# Altium project UCLA-DRS4-2.1.PrjPCB (part 3 of 7)

## Sheet MarsCarrier.SchDoc: My title
size A3; Organization: University of California; Address1: 475 Portola Plaza; Address2: Los Angeles, CA 90095; Revision: R01; SheetNumber: 1; SheetTotal: 1
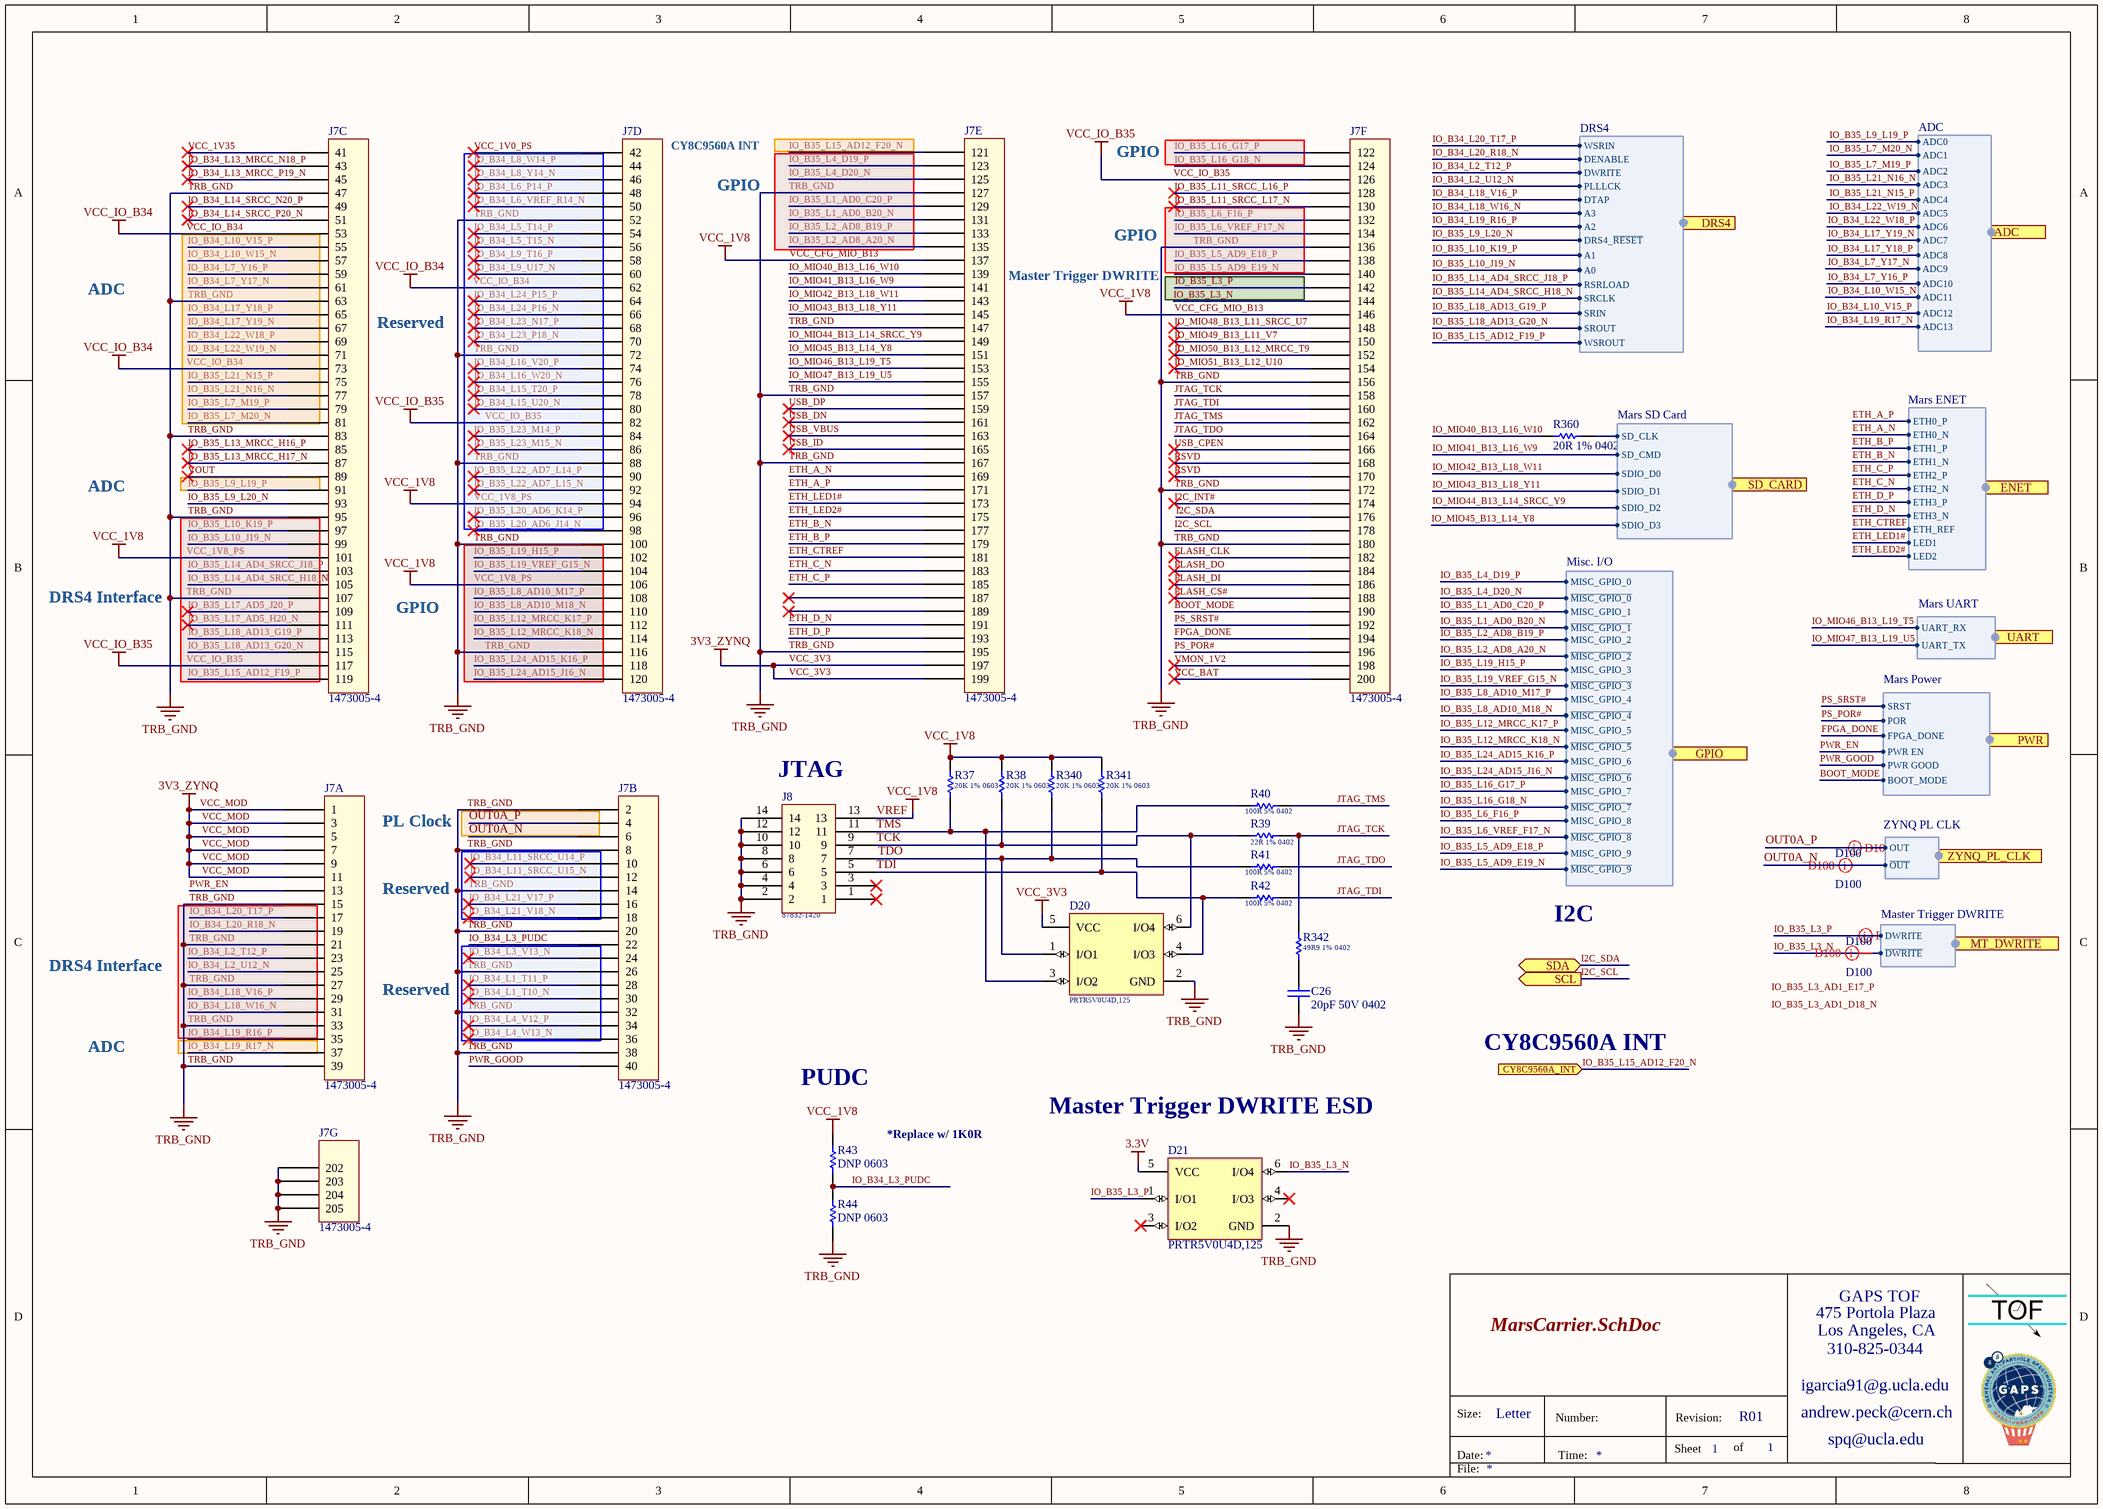
[diagram p6: MarsCarrier.SchDoc]

### Parts
C26  Capacitance: 20pF 50V 0402  [Cap_Murata_GJM1555C1H200GB01D_20pF]  (hidden comment: Cap_Murata_GJM1555C1H200GB01D_20pF)
D20  PRTR5V0U4D,125  [PRTR5V0U4D,125]
D21  PRTR5V0U4D,125  [PRTR5V0U4D,125]
J7  Series: 1473005-4  [DIMM_TE_Connectivity_1473005-4_200POS]  (hidden comment: DIMM_TE_Connectivity_1473005-4_200POS)  (parts A,B,C,D,E,F,G of 7)
J8  Series: 87832-1420  [Header_Molex_87832-1420_14POS]  (hidden comment: Header_Molex_87832-1420_14POS)
R37  20K 1% 0603  [RESC0603(1608)_L]
R38  20K 1% 0603  [RESC0603(1608)_L]
R39  22R 1% 0402  [RESC0402(1005)_L]
R40  100R 5% 0402  [RESC0402(1005)_L]
R41  100R 5% 0402  [RESC0402(1005)_L]
R42  100R 5% 0402  [RESC0402(1005)_L]
R43  Resistance: DNP 0603  [RES_DNP_0603]  (hidden comment: RES_DNP_0603)
R44  Resistance: DNP 0603  [RES_DNP_0603]  (hidden comment: RES_DNP_0603)
R340  20K 1% 0603  [RESC0603(1608)_L]
R341  20K 1% 0603  [RESC0603(1608)_L]
R342  49R9 1% 0402  [RESC0402(1005)_L]
R360  Resistance: 20R 1% 0402  [Res_ROHM_SFR01MZPF20R0_20_Ohm]  (hidden comment: Res_ROHM_SFR01MZPF20R0_20_Ohm)

### Ports
ADC (harness ADC), CY8C9560A_INT (in), DRS4 (harness DRS4), ENET (harness Mars ENET), GPIO (harness Misc. I/O), MT_DWRITE (harness Master Trigger DWRITE), PWR (harness Mars Power), SCL (out), SD_CARD (harness Mars SD Card), SDA (bidir), UART (harness Mars UART), ZYNQ_PL_CLK (harness ZYNQ PL CLK)

### Harnesses
Mars SD Card: SDIO_D2, SDIO_D1, SDIO_D0, SD_CMD, SD_CLK, SDIO_D3
Mars UART: UART_RX, UART_TX
ADC: ADC0, ADC1, ADC2, ADC3, ADC4, ADC5, ADC6, ADC7, ADC8, ADC9, ADC10, ADC11, ADC12, ADC13
Mars ENET: ETH0_P, ETH0_N, ETH1_P, ETH1_N, ETH2_P, ETH2_N, ETH3_P, ETH3_N, ETH_REF, LED1, LED2
Mars Power: PWR GOOD, PWR EN, FPGA_DONE, SRST, POR, BOOT_MODE
ZYNQ PL CLK: OUT, ~{OUT}
Misc. I/O: MISC_GPIO_0, ~{MISC_GPIO_0}, MISC_GPIO_1, ~{MISC_GPIO_1}, MISC_GPIO_2, ~{MISC_GPIO_2}, MISC_GPIO_3, ~{MISC_GPIO_3}, MISC_GPIO_4, ~{MISC_GPIO_4}, MISC_GPIO_5, ~{MISC_GPIO_5}, MISC_GPIO_6, ~{MISC_GPIO_6}, MISC_GPIO_7, ~{MISC_GPIO_7}, MISC_GPIO_8, ~{MISC_GPIO_8}, MISC_GPIO_9, ~{MISC_GPIO_9}
Master Trigger DWRITE: DWRITE, ~{DWRITE}
DRS4: A3, A2, A1, A0, DTAP, SROUT, SRCLK, SRIN, RSRLOAD, WSROUT, DWRITE, PLLLCK, WSRIN, DENABLE, DRS4_~{RESET}

### Nets
3.3V: D21.5(VCC)
TRB_GND: C26.1 D20.2(GND) D21.2(GND) J7.2 J7.8 J7.14 J7.15 J7.20 J7.21 J7.26 J7.27 J7.32 J7.33 J7.38 J7.39 J7.47 J7.52 J7.63 J7.72 J7.83 J7.88 J7.95 J7.100 J7.107 J7.116 J7.127 J7.136 J7.147 J7.156 J7.157 J7.167 J7.172 J7.180 J7.195 J7.202 J7.203 J7.204 J7.205 J8.2 J8.4 J8.6 J8.8 J8.10 J8.12 J8.14 R44.2
VCC_1V8_PS: J7.94 J7.101 J7.106 J7.137 J7.146 J8.13 R37.2 R38.2 R43.1 R340.2 R341.2  [also labelled VCC_1V8, VCC_CFG_MIO_B13, VREF]
VCC_3V3: D20.5(VCC) J7.1 J7.3 J7.5 J7.7 J7.9 J7.11 J7.197 J7.199  [also labelled 3V3_ZYNQ, VCC_MOD]
VCC_IO_B34: J7.53 J7.62 J7.73 J7.82 J7.117 J7.126  [also labelled VCC_IO_B35]
BOOT_MODE: J7.190 ; port PWR.BOOT_MODE
ETH_A_N: J7.169 ; port ENET.ETH0_N
ETH_A_P: J7.171 ; port ENET.ETH0_P
ETH_B_N: J7.177 ; port ENET.ETH1_N
ETH_B_P: J7.179 ; port ENET.ETH1_P
ETH_C_N: J7.183 ; port ENET.ETH2_N
ETH_C_P: J7.185 ; port ENET.ETH2_P
ETH_CTREF: J7.181 ; port ENET.ETH_REF
ETH_D_N: J7.191 ; port ENET.ETH3_N
ETH_D_P: J7.193 ; port ENET.ETH3_P
ETH_LED1#: J7.173 ; port ENET.LED1
ETH_LED2#: J7.175 ; port ENET.LED2
FLASH_CLK: J7.182
FLASH_CS#: J7.188
FLASH_DI: J7.186
FLASH_DO: J7.184
FPGA_DONE: J7.194 ; port PWR.FPGA_DONE
I2C_INT#: J7.174
I2C_SCL: J7.178 ; port SCL
I2C_SDA: J7.176 ; port SDA
IO_B34_L1_T10_N: J7.30
IO_B34_L1_T11_P: J7.28
IO_B34_L2_T12_P: J7.23 ; port DRS4.DWRITE  [project net DRS4_DWRITE]
IO_B34_L2_U12_N: J7.25 ; port DRS4.PLLLCK  [project net DRS4_PLLLCK]
IO_B34_L3_PUDC: J7.22 R43.2 R44.1
IO_B34_L3_V13_N: J7.24
IO_B34_L4_V12_P: J7.34
IO_B34_L4_W13_N: J7.36
IO_B34_L5_T14_P: J7.54
IO_B34_L5_T15_N: J7.56
IO_B34_L6_P14_P: J7.48
IO_B34_L6_VREF_R14_N: J7.50
IO_B34_L7_Y16_P: J7.59 ; port ADC.ADC10
IO_B34_L7_Y17_N: J7.61 ; port ADC.ADC9
IO_B34_L8_W14_P: J7.44
IO_B34_L8_Y14_N: J7.46
IO_B34_L9_T16_P: J7.58
IO_B34_L9_U17_N: J7.60
IO_B34_L10_V15_P: J7.55 ; port ADC.ADC12
IO_B34_L10_W15_N: J7.57 ; port ADC.ADC11
IO_B34_L11_SRCC_U14_P: J7.10
IO_B34_L11_SRCC_U15_N: J7.12
IO_B34_L13_MRCC_N18_P: J7.43
IO_B34_L13_MRCC_P19_N: J7.45
IO_B34_L14_SRCC_N20_P: J7.49
IO_B34_L14_SRCC_P20_N: J7.51
IO_B34_L15_T20_P: J7.78
IO_B34_L15_U20_N: J7.80
IO_B34_L16_V20_P: J7.74
IO_B34_L16_W20_N: J7.76
IO_B34_L17_Y18_P: J7.65 ; port ADC.ADC8
IO_B34_L17_Y19_N: J7.67 ; port ADC.ADC7
IO_B34_L18_V16_P: J7.29 ; port DRS4.DTAP  [project net DRS4_DTAP]
IO_B34_L18_W16_N: J7.31 ; port DRS4.A3  [project net DRS4_A3]
IO_B34_L19_R16_P: J7.35 ; port DRS4.A2  [project net DRS4_A2]
IO_B34_L19_R17_N: J7.37 ; port ADC.ADC13
IO_B34_L20_R18_N: J7.19 ; port DRS4.DENABLE  [project net DRS4_DENABLE]
IO_B34_L20_T17_P: J7.17 ; port DRS4.WSRIN  [project net DRS4_WSRIN]
IO_B34_L21_V17_P: J7.16
IO_B34_L21_V18_N: J7.18
IO_B34_L22_W18_P: J7.69 ; port ADC.ADC6
IO_B34_L22_W19_N: J7.71 ; port ADC.ADC5
IO_B34_L23_N17_P: J7.68
IO_B34_L23_P18_N: J7.70
IO_B34_L24_P15_P: J7.64
IO_B34_L24_P16_N: J7.66
IO_B35_L1_AD0_B20_N: J7.131 ; port GPIO.~{MISC_GPIO_1}  [project net GPIO1_N]
IO_B35_L1_AD0_C20_P: J7.129 ; port GPIO.MISC_GPIO_1  [project net GPIO1_P]
IO_B35_L2_AD8_A20_N: J7.135 ; port GPIO.~{MISC_GPIO_2}  [project net GPIO2_N]
IO_B35_L2_AD8_B19_P: J7.133 ; port GPIO.MISC_GPIO_2  [project net GPIO2_P]
IO_B35_L3_N: D21.6(I/O4) J7.144 ; port MT_DWRITE.~{DWRITE}
IO_B35_L3_P: D21.1(I/O1) J7.142 ; port MT_DWRITE.DWRITE
IO_B35_L4_D19_P: J7.123 ; port GPIO.MISC_GPIO_0  [project net GPIO0_P]
IO_B35_L4_D20_N: J7.125 ; port GPIO.~{MISC_GPIO_0}  [project net GPIO0_N]
IO_B35_L5_AD9_E18_P: J7.138 ; port GPIO.MISC_GPIO_9  [project net GPIO9_P]
IO_B35_L5_AD9_E19_N: J7.140 ; port GPIO.~{MISC_GPIO_9}  [project net GPIO9_N]
IO_B35_L6_F16_P: J7.132 ; port GPIO.MISC_GPIO_8  [project net GPIO8_P]
IO_B35_L6_VREF_F17_N: J7.134 ; port GPIO.~{MISC_GPIO_8}  [project net GPIO8_N]
IO_B35_L7_M19_P: J7.79 ; port ADC.ADC2
IO_B35_L7_M20_N: J7.81 ; port ADC.ADC1
IO_B35_L8_AD10_M17_P: J7.108 ; port GPIO.MISC_GPIO_4  [project net GPIO4_P]
IO_B35_L8_AD10_M18_N: J7.110 ; port GPIO.~{MISC_GPIO_4}  [project net GPIO4_N]
IO_B35_L9_L19_P: J7.91 ; port ADC.ADC0
IO_B35_L9_L20_N: J7.93 ; port DRS4.DRS4_~{RESET}  [project net DRS4~{_RESET}]
IO_B35_L10_J19_N: J7.99 ; port DRS4.A0  [project net DRS4_A0]
IO_B35_L10_K19_P: J7.97 ; port DRS4.A1  [project net DRS4_A1]
IO_B35_L11_SRCC_L16_P: J7.128
IO_B35_L11_SRCC_L17_N: J7.130
IO_B35_L12_MRCC_K17_P: J7.112 ; port GPIO.MISC_GPIO_5  [project net GPIO5_P]
IO_B35_L12_MRCC_K18_N: J7.114 ; port GPIO.~{MISC_GPIO_5}  [project net GPIO5_N]
IO_B35_L13_MRCC_H16_P: J7.85
IO_B35_L13_MRCC_H17_N: J7.87
IO_B35_L14_AD4_SRCC_H18_N: J7.105 ; port DRS4.SRCLK  [project net DRS4_SRCLK]
IO_B35_L14_AD4_SRCC_J18_P: J7.103 ; port DRS4.RSRLOAD  [project net DRS4_RSRLOAD]
IO_B35_L15_AD12_F19_P: J7.119 ; port DRS4.WSROUT  [project net DRS4_WSROUT]
IO_B35_L15_AD12_F20_N: J7.121 ; port CY8C9560A_INT
IO_B35_L16_G17_P: J7.122 ; port GPIO.MISC_GPIO_7  [project net GPIO7_P]
IO_B35_L16_G18_N: J7.124 ; port GPIO.~{MISC_GPIO_7}  [project net GPIO7_N]
IO_B35_L17_AD5_H20_N: J7.111
IO_B35_L17_AD5_J20_P: J7.109
IO_B35_L18_AD13_G19_P: J7.113 ; port DRS4.SRIN  [project net DRS4_SRIN]
IO_B35_L18_AD13_G20_N: J7.115 ; port DRS4.SROUT  [project net DRS4_SROUT]
IO_B35_L19_H15_P: J7.102 ; port GPIO.MISC_GPIO_3  [project net GPIO3_P]
IO_B35_L19_VREF_G15_N: J7.104 ; port GPIO.~{MISC_GPIO_3}  [project net GPIO3_N]
IO_B35_L20_AD6_J14_N: J7.98
IO_B35_L20_AD6_K14_P: J7.96
IO_B35_L21_N15_P: J7.75 ; port ADC.ADC4
IO_B35_L21_N16_N: J7.77 ; port ADC.ADC3
IO_B35_L22_AD7_L14_P: J7.90
IO_B35_L22_AD7_L15_N: J7.92
IO_B35_L23_M14_P: J7.84
IO_B35_L23_M15_N: J7.86
IO_B35_L24_AD15_J16_N: J7.120 ; port GPIO.~{MISC_GPIO_6}  [project net GPIO6_N]
IO_B35_L24_AD15_K16_P: J7.118 ; port GPIO.MISC_GPIO_6  [project net GPIO6_P]
IO_MIO40_B13_L16_W10: J7.139 R360.1
IO_MIO41_B13_L16_W9: J7.141 ; port SD_CARD.SD_CMD
IO_MIO42_B13_L18_W11: J7.143 ; port SD_CARD.SDIO_D0
IO_MIO43_B13_L18_Y11: J7.145 ; port SD_CARD.SDIO_D1
IO_MIO44_B13_L14_SRCC_Y9: J7.149 ; port SD_CARD.SDIO_D2
IO_MIO45_B13_L14_Y8: J7.151 ; port SD_CARD.SDIO_D3
IO_MIO46_B13_L19_T5: J7.153 ; port UART.UART_RX
IO_MIO47_B13_L19_U5: J7.155 ; port UART.UART_TX
IO_MIO48_B13_L11_SRCC_U7: J7.148
IO_MIO49_B13_L11_V7: J7.150
IO_MIO50_B13_L12_MRCC_T9: J7.152
IO_MIO51_B13_L12_U10: J7.154
JTAG_TCK: J7.158 R39.1 R342.1
JTAG_TDI: J7.160 R42.1
JTAG_TDO: J7.164 R41.1
JTAG_TMS: J7.162 R40.1
OUT0A_N: J7.6 ; port ZYNQ_PL_CLK.~{OUT}
OUT0A_P: J7.4 ; port ZYNQ_PL_CLK.OUT
PS_POR#: J7.196 ; port PWR.POR  [project net POR]
PS_SRST#: J7.192 ; port PWR.SRST
PWR_EN: J7.13 ; port PWR.PWR EN  [project net POWER_EN]
PWR_GOOD: J7.40 ; port PWR.PWR GOOD  [project net POWER_GOOD]
RSVD: J7.168 J7.170
SDIO_CLK: R360.2 ; port SD_CARD.SD_CLK
TCK: D20.6(I/O4) J8.9 R38.1 R39.2
TDI: D20.4(I/O3) J8.5 R42.2 R341.1
TDO: D20.1(I/O1) J8.7 R41.2 R340.1
TMS: D20.3(I/O2) J8.11 R37.1 R40.2
USB_CPEN: J7.166
USB_DN: J7.161
USB_DP: J7.159
USB_ID: J7.165
USB_VBUS: J7.163
VCC_1V0_PS: J7.42
VCC_1V35: J7.41
VCC_BAT: J7.200
VMON_1V2: J7.198
VOUT: J7.89
NetC26_2: C26.2 R342.2

Not connected (* = marked no-connect by the designer): D21 3(I/O2)* 4(I/O3)*; J7 187* 189*; J8 1* 3*

### Layout directives
differential pair; differential pair class D100: IO_B35_L3_N, IO_B35_L3_P, OUT0A_N, OUT0A_P

### Notes on the sheet
- (near J7) CY8C9560A INT
- GPIO
- ADC
- (near J7) Master Trigger DWRITE
- (near J7) Reserved
- DRS4 Interface
- (near J8) JTAG
- PL Clock
- Reserved
- I2C
- CY8C9560A INT
- PUDC
- (near D21) Master Trigger DWRITE ESD
- *Replace w/ 1K0R
- Labels drawn without touching a wire or pin: IO_B35_L3_AD1_D18_N, IO_B35_L3_AD1_E17_P
- 475 Portola Plaza
- GAPS TOF
- igarcia91@g.ucla.edu
- Los Angeles, CA
- 310-825-0344
- Size:
- Date:
- Letter
- Number:
- Time:
- Sheet
- Revision:
- of
- andrew.peck@cern.ch
- spq@ucla.edu
- File:

### Library data of the parts
C26 = Cap_Murata_GJM1555C1H200GB01D_20pF: Multilayer Ceramic Capacitors MLCC - SMD/SMT 0402 20pF 50Volts C0G 2%; Supplier 1: Mouser; Supplier Part Number 1: 81-GJM1555C1H200GB01
D20 D21 = PRTR5V0U4D,125: ESD Suppressors / TVS Diodes 5.5V QUAD R-R ESD ULTRA LOW CAP; Supplier 1: Mouser; Supplier Part Number 1: 771-PRTR5V0U4D-T/R
J7 = DIMM_TE_Connectivity_1473005-4_200POS: DIMM Connectors DDR2 SODIMM 200P STANDARD HOUSING; Supplier 1: Mouser; Supplier Part Number 1: 571-1473005-4
J8 = Header_Molex_87832-1420_14POS: Headers & Wire Housings 14P SMD PB FREE SHRD; Supplier Part Number 1: 538-87832-1420; Supplier 1: Mouser
R37 R38 R340 R341 = CMP-1012-00655-1: 20K 0.1W 1% 0603 (1608 Metric)  SMD; Case-Metric: 1608; Case-EIA: 0603; Value: 20000.00 Ohm; Technology: SMT; Tolerance: 1 %; Power: 0.1 W
R39 = CMP-1011-00320-1: as R166 on sheet ANA_FE; Tolerance: 1 %; Technology: SMT; Power: 0.063 W
R40-R42 = CMP-1011-00050-1: 100R 0.063W 5% 0402 (1005 Metric)  SMD; Case-EIA: 0402; Value: 100.00 Ohm; Case-Metric: 1005; Tolerance: 5 %; Technology: SMT; Power: 0.063 W
R43 R44 = RES_DNP_0603: 0603 Do not place resistor
R342 = CMP-1011-00363-1: 49R9 0.063W 1% 0402 (1005 Metric)  SMD; Case-EIA: 0402; Case-Metric: 1005; Value: 49.90 Ohm; Power: 0.063 W; Technology: SMT; Tolerance: 1 %
R360 = Res_ROHM_SFR01MZPF20R0_20_Ohm: 20R 62.5mW 1% 0402 (1005 Metric)  SMD; Supplier 1: Mouser; Supplier Part Number 1: 755-SFR01MZPF20R0

## Sheet ENET.SchDoc: My title
size A3; Organization: University of California; Address1: 475 Portola Plaza; Address2: Los Angeles, CA 90095; Revision: R01; SheetNumber: 1; SheetTotal: 1
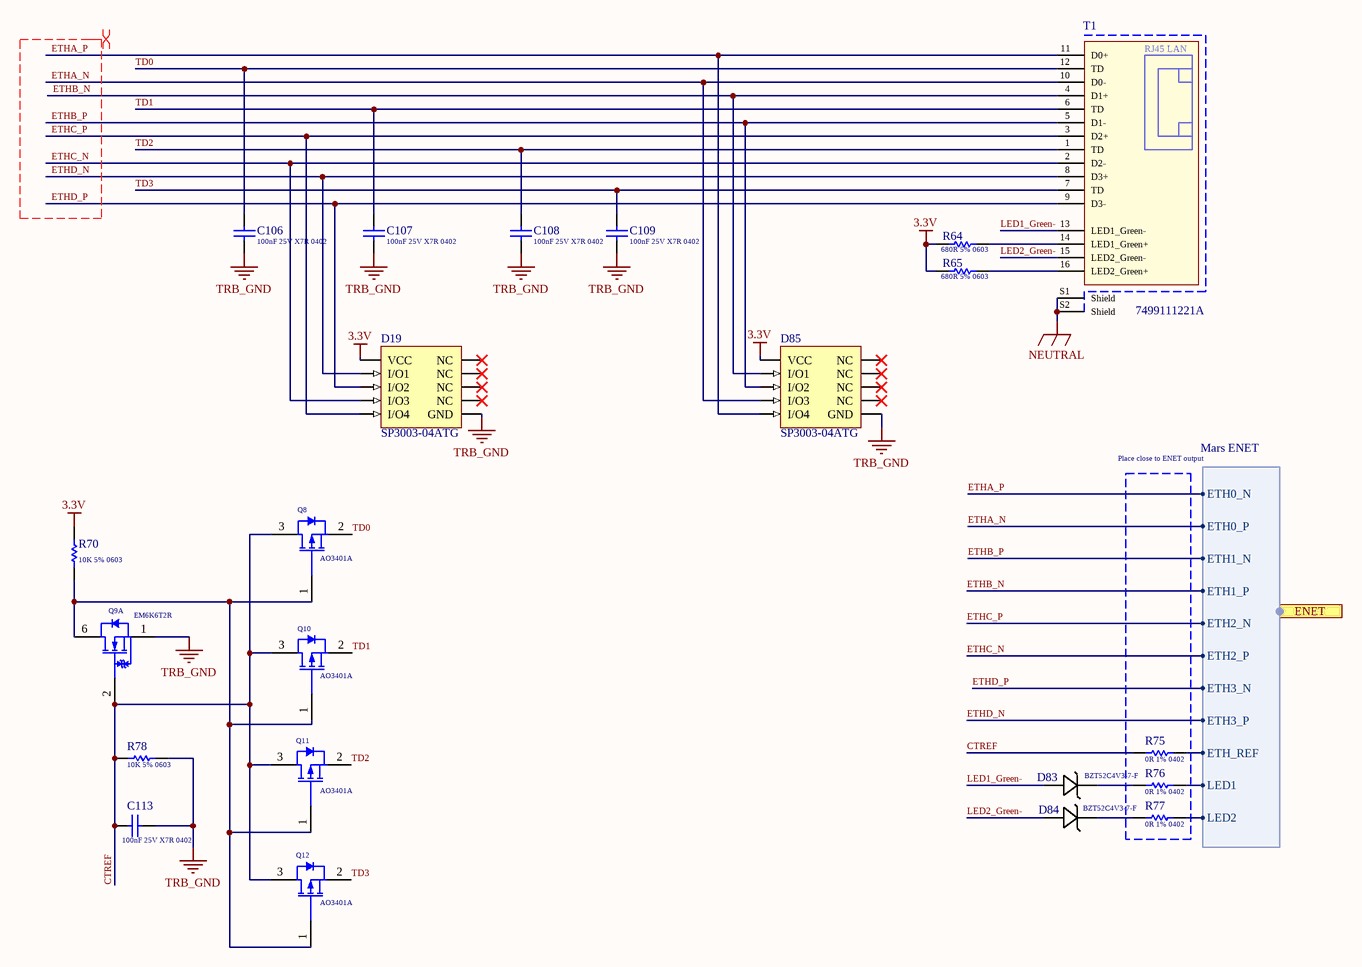
[diagram p7: ENET.SchDoc]

### Parts
C106  Capacitance: 100nF 25V X7R 0402  [Cap_Taiyo_Yuden_TMK105B7104KV-FR_100nF]  (hidden comment: Cap_Taiyo_Yuden_TMK105B7104KV-FR_100nF)
C107  Capacitance: 100nF 25V X7R 0402  [Cap_Taiyo_Yuden_TMK105B7104KV-FR_100nF]  (hidden comment: Cap_Taiyo_Yuden_TMK105B7104KV-FR_100nF)
C108  Capacitance: 100nF 25V X7R 0402  [Cap_Taiyo_Yuden_TMK105B7104KV-FR_100nF]  (hidden comment: Cap_Taiyo_Yuden_TMK105B7104KV-FR_100nF)
C109  Capacitance: 100nF 25V X7R 0402  [Cap_Taiyo_Yuden_TMK105B7104KV-FR_100nF]  (hidden comment: Cap_Taiyo_Yuden_TMK105B7104KV-FR_100nF)
C113  Capacitance: 100nF 25V X7R 0402  [Cap_Taiyo_Yuden_TMK105B7104KV-FR_100nF]  (hidden comment: Cap_Taiyo_Yuden_TMK105B7104KV-FR_100nF)
D19  Series: SP3003-04ATG  [Diode_SP3003-04ATG_LVDS_ESD]  (hidden comment: Diode_SP3003-04ATG_LVDS_ESD)
D83  BZT52C4V3-7-F  [SOD123]
D84  BZT52C4V3-7-F  [SOD123]
D85  Series: SP3003-04ATG  [Diode_SP3003-04ATG_LVDS_ESD]  (hidden comment: Diode_SP3003-04ATG_LVDS_ESD)
Q8  Series: AO3401A  [Mos_Alpha&Omega_AO3401A_4A]  (hidden comment: Mos_Alpha&Omega_AO3401A_4A)
Q9  Series: EM6K6T2R  [Mos_ROHM_EM6K6T2R_N_300mA]  (hidden comment: Mos_ROHM_EM6K6T2R_N_300mA)  (part A of 2)
Q10  Series: AO3401A  [Mos_Alpha&Omega_AO3401A_4A]  (hidden comment: Mos_Alpha&Omega_AO3401A_4A)
Q11  Series: AO3401A  [Mos_Alpha&Omega_AO3401A_4A]  (hidden comment: Mos_Alpha&Omega_AO3401A_4A)
Q12  Series: AO3401A  [Mos_Alpha&Omega_AO3401A_4A]  (hidden comment: Mos_Alpha&Omega_AO3401A_4A)
R64  680R 5% 0603  [RESC0603(1608)_L]
R65  680R 5% 0603  [RESC0603(1608)_L]
R70  10K 5% 0603  [RESC0603(1608)_L]
R75  Resistance: 0R 1% 0402  [Res_Vishay_CRCW04020000Z0EDC_0_Ohm]  (hidden comment: Res_Vishay_CRCW04020000Z0EDC_0_Ohm)
R76  Resistance: 0R 1% 0402  [Res_Vishay_CRCW04020000Z0EDC_0_Ohm]  (hidden comment: Res_Vishay_CRCW04020000Z0EDC_0_Ohm)
R77  Resistance: 0R 1% 0402  [Res_Vishay_CRCW04020000Z0EDC_0_Ohm]  (hidden comment: Res_Vishay_CRCW04020000Z0EDC_0_Ohm)
R78  10K 5% 0603  [RESC0603(1608)_L]
T1  7499111221A  [7499111221A]

### Ports
ENET (harness Mars ENET)

### Harnesses
Mars ENET: ETH0_P, ETH0_N, ETH1_P, ETH1_N, ETH2_P, ETH2_N, ETH3_P, ETH3_N, ETH_REF, LED1, LED2

### Nets
3.3V: D19.3(VCC) D85.3(VCC) R64.1 R65.1 R70.2
NEUTRAL: T1.S1(Shield) T1.S2(Shield)
TRB_GND: C106.1 C107.1 C108.1 C109.1 C113.1 D19.8(GND) D85.8(GND) Q9.1(S) R78.1
CTREF: C113.2 Q8.3(D) Q9.2(G) Q10.3(D) Q11.3(D) Q12.3(D) R75.1 R78.2
ETH_CTREF: R75.2 ; port ENET.ETH_REF
ETH_LED1#: R76.2 ; port ENET.LED1
ETH_LED2#: R77.2 ; port ENET.LED2
ETHA_N: D85.4(I/O3) T1.10(D0-) ; port ENET.ETH0_P  [project net ETH_A_P]
ETHA_P: D85.5(I/O4) T1.11(D0+) ; port ENET.ETH0_N  [project net ETH_A_N]
ETHB_N: D85.1(I/O1) T1.4(D1+) ; port ENET.ETH1_P  [project net ETH_B_P]
ETHB_P: D85.2(I/O2) T1.5(D1-) ; port ENET.ETH1_N  [project net ETH_B_N]
ETHC_N: D19.4(I/O3) T1.2(D2-) ; port ENET.ETH2_P  [project net ETH_C_P]
ETHC_P: D19.5(I/O4) T1.3(D2+) ; port ENET.ETH2_N  [project net ETH_C_N]
ETHD_N: D19.1(I/O1) T1.8(D3+) ; port ENET.ETH3_P  [project net ETH_D_P]
ETHD_P: D19.2(I/O2) T1.9(D3-) ; port ENET.ETH3_N  [project net ETH_D_N]
LED1_Green-: D83.2 T1.13(LED1_Green-)
LED2_Green-: D84.2 T1.15(LED2_Green-)
TD0: C106.2 Q8.2(S) T1.12(TD)
TD1: C107.2 Q10.2(S) T1.6(TD)
TD2: C108.2 Q11.2(S) T1.1(TD)
TD3: C109.2 Q12.2(S) T1.7(TD)
NetD83_1: D83.1 R76.1
NetD84_1: D84.1 R77.1
NetQ8_1: Q8.1(G) Q9.6(D) Q10.1(G) Q11.1(G) Q12.1(G) R70.1
NetR64_2: R64.2 T1.14(LED1_Green+)
NetR65_2: R65.2 T1.16(LED2_Green+)

Not connected (* = marked no-connect by the designer): D19 6(NC)* 7(NC)* 9(NC)* 10(NC)*; D85 6(NC)* 7(NC)* 9(NC)* 10(NC)*

### Layout directives
differential pair: ETHA_N, ETHA_P, ETHB_N, ETHB_P, ETHC_N, ETHC_P, ETHD_N, ETHD_P

### Notes on the sheet
- Place close to ENET output
- 475 Portola Plaza
- GAPS TOF
- igarcia91@g.ucla.edu
- Los Angeles, CA
- 310-825-0344
- Size:
- Date:
- Letter
- Number:
- Time:
- Sheet
- Revision:
- of
- andrew.peck@cern.ch
- spq@ucla.edu
- File:
- (in symbol 7499111221A) RJ45 LAN

### Library data of the parts
C106-C109 C113 = Cap_Taiyo_Yuden_TMK105B7104KV-FR_100nF: CAP CER 100nF 25V X7R 0402; Supplier 1: Mouser; Supplier Part Number 1: 963-TMK105B7104KV-FR
D19 D85 = Diode_SP3003-04ATG_LVDS_ESD: ESD Suppressors / TVS Diodes 4 Ch 8kV 0.65pF SPA; Supplier 1: Mouser; Supplier Part Number 1: 576-SP3003-04ATG
D83 D84 = BZT52C4V3-7-F: Zener Diodes 500mW 4.3V Zener AEC-Q101 Qualified; Vendor: Diodes Inc; Built_By: EMA_UL_Team; Type: DEV; C: Copyright (C) 2015 Accelerated Designs. All rights reserved; Manufacturer_Part_Number: BZT52C4V3-7-F; RefDes: RefDes; Supplier 1: Mouser; Supplier Part Number 1: 621-BZT52C4V3-F; Series: BZT52C4V3-7-F
Q8 Q10-Q12 = Mos_Alpha&Omega_AO3401A_4A: P-Channel 30V 4A (Ta) 1.4W (Ta) Surface Mount SOT-23-3L; Supplier 1: Digi-key; Supplier Part Number 1: 785-1001-1-ND
Q9 = Mos_ROHM_EM6K6T2R_N_300mA: MOSFET Small Signal Dual N-CH 20V .3A .15W; Supplier Part Number 1: 755-EM6K6T2R; Supplier 1: Mouser
R64 R65 = CMP-1012-00070-1: as R140 on sheet DRS4_ADC; Tolerance: 5 %; Technology: SMT; Power: 0.1 W
R70 R78 = CMP-1012-00098-1: as R135 on sheet DRS4_ADC; Technology: SMT; Tolerance: 5 %; Power: 0.1 W
R75-R77 = Res_Vishay_CRCW04020000Z0EDC_0_Ohm: 0R 0.062W 1% 0402 (1005 Metric)  SMD; Supplier 1: Mouser; Supplier Part Number 1: 71-CRCW04020000Z0EDC
T1 = 7499111221A: WE-RJ45 LAN Transformer, 10/100/1000 Base-T, THT, Port 1x1, Tab Up; PoE: non-PoE; LED (Left-Right): green-green; USB: No; ComponentLink1Description: Manufacturer; ComponentLink1URL: http://www.we-online.de; ComponentLink2Description: Datasheet; ComponentLink2URL: http://katalog.we-online.de/pbs/datasheet/7499111221A.pdf; Part Number: 7499111221A; Published Date: Dec. 2017; Publisher: Wurth Elektronik; Tab Position: Up; Port Number: 1x1; Data Rate: 10/100/1000 Base-T; Operating Temperature: 0 to +70 degC; Mounting Technology: THT; Supplier Part Number 1: 710-7499111221A; Supplier 1: Mouser

## Sheet DAC.SchDoc: My title
size A3; Organization: University of California; Address1: 475 Portola Plaza; Address2: Los Angeles, CA 90095; Revision: R01; SheetNumber: 1; SheetTotal: 1
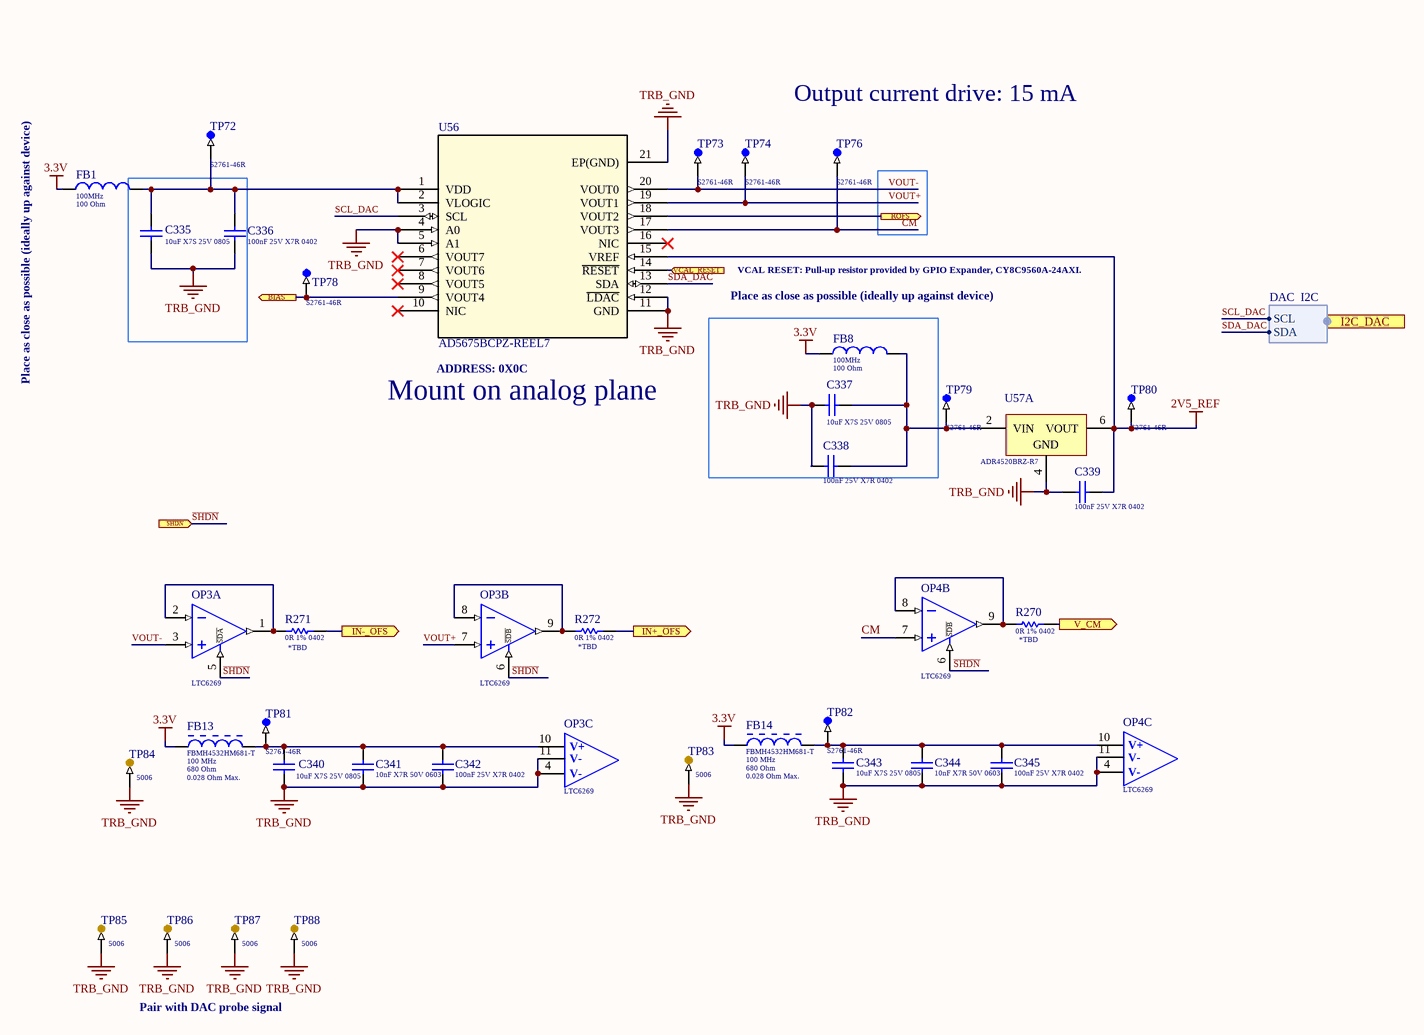
[diagram p8: DAC.SchDoc]

### Parts
C335  Capacitance: 10uF X7S 25V 0805  [Cap_Murata_ GRM21BC71E106ME11L_10uF]  (hidden comment: Cap_Murata_ GRM21BC71E106ME11L_10uF)
C336  Capacitance: 100nF 25V X7R 0402  [Cap_Taiyo_Yuden_TMK105B7104KV-FR_100nF]  (hidden comment: Cap_Taiyo_Yuden_TMK105B7104KV-FR_100nF)
C337  Capacitance: 10uF X7S 25V 0805  [Cap_Murata_ GRM21BC71E106ME11L_10uF]  (hidden comment: Cap_Murata_ GRM21BC71E106ME11L_10uF)
C338  Capacitance: 100nF 25V X7R 0402  [Cap_Taiyo_Yuden_TMK105B7104KV-FR_100nF]  (hidden comment: Cap_Taiyo_Yuden_TMK105B7104KV-FR_100nF)
C339  Capacitance: 100nF 25V X7R 0402  [Cap_Taiyo_Yuden_TMK105B7104KV-FR_100nF]  (hidden comment: Cap_Taiyo_Yuden_TMK105B7104KV-FR_100nF)
C340  Capacitance: 10uF X7S 25V 0805  [Cap_Murata_ GRM21BC71E106ME11L_10uF]  (hidden comment: Cap_Murata_ GRM21BC71E106ME11L_10uF)
C341  Capacitance: 10nF X7R 50V 0603  [Kemet_C0603_0]  (hidden comment: Cap_Kemet_C0603C103J5RACTU_eec)
C342  Capacitance: 100nF 25V X7R 0402  [Cap_Taiyo_Yuden_TMK105B7104KV-FR_100nF]  (hidden comment: Cap_Taiyo_Yuden_TMK105B7104KV-FR_100nF)
C343  Capacitance: 10uF X7S 25V 0805  [Cap_Murata_ GRM21BC71E106ME11L_10uF]  (hidden comment: Cap_Murata_ GRM21BC71E106ME11L_10uF)
C344  Capacitance: 10nF X7R 50V 0603  [Kemet_C0603_0]  (hidden comment: Cap_Kemet_C0603C103J5RACTU_eec)
C345  Capacitance: 100nF 25V X7R 0402  [Cap_Taiyo_Yuden_TMK105B7104KV-FR_100nF]  (hidden comment: Cap_Taiyo_Yuden_TMK105B7104KV-FR_100nF)
FB1  Measuring Frequency: 100MHz  Impedance: 100 Ohm  [FB_Wurth_Electronics_742792731_100Ohms]  (hidden comment: 742792731)
FB8  Measuring Frequency: 100MHz  Impedance: 100 Ohm  [FB_Wurth_Electronics_742792731_100Ohms]  (hidden comment: 742792731)
FB13  Measuring Frequency: 100 MHz  Nominal Impedance: 680 Ohm  DC Resistance: 0.028 Ohm Max.  [TAYO-FBMH4532-2_V]  (hidden comment: FBMH4532HM681-T)
FB14  Measuring Frequency: 100 MHz  Nominal Impedance: 680 Ohm  DC Resistance: 0.028 Ohm Max.  [TAYO-FBMH4532-2_V]  (hidden comment: FBMH4532HM681-T)
OP3  Series: LTC6269  [OpAmp_Linear_Technology_ LTC6269HDD#PBF_500Mhz]  (hidden comment: OpAmp_Linear_Technology_ LTC6269HDD#PBF_500Mhz)  (parts A,B,C of 3)
OP4  Series: LTC6269  [OpAmp_Linear_Technology_ LTC6269HDD#PBF_500Mhz]  (hidden comment: OpAmp_Linear_Technology_ LTC6269HDD#PBF_500Mhz)  (parts B,C of 3)
R270  Resistance: 0R 1% 0402  [Res_Vishay_CRCW04020000Z0EDC_0_Ohm]  (hidden comment: Res_Vishay_CRCW04020000Z0EDC_0_Ohm)
R271  Resistance: 0R 1% 0402  [Res_Vishay_CRCW04020000Z0EDC_0_Ohm]  (hidden comment: Res_Vishay_CRCW04020000Z0EDC_0_Ohm)
R272  Resistance: 0R 1% 0402  [Res_Vishay_CRCW04020000Z0EDC_0_Ohm]  (hidden comment: Res_Vishay_CRCW04020000Z0EDC_0_Ohm)
TP72  Series: S2761-46R  [TP_Harwin_S2761_46R]  (hidden comment: TP_Harwin_S2761_46R)
TP73  Series: S2761-46R  [TP_Harwin_S2761_46R]  (hidden comment: TP_Harwin_S2761_46R)
TP74  Series: S2761-46R  [TP_Harwin_S2761_46R]  (hidden comment: TP_Harwin_S2761_46R)
TP76  Series: S2761-46R  [TP_Harwin_S2761_46R]  (hidden comment: TP_Harwin_S2761_46R)
TP78  Series: S2761-46R  [TP_Harwin_S2761_46R]  (hidden comment: TP_Harwin_S2761_46R)
TP79  Series: S2761-46R  [TP_Harwin_S2761_46R]  (hidden comment: TP_Harwin_S2761_46R)
TP80  Series: S2761-46R  [TP_Harwin_S2761_46R]  (hidden comment: TP_Harwin_S2761_46R)
TP81  Series: S2761-46R  [TP_Harwin_S2761_46R]  (hidden comment: TP_Harwin_S2761_46R)
TP82  Series: S2761-46R  [TP_Harwin_S2761_46R]  (hidden comment: TP_Harwin_S2761_46R)
TP83  Series: 5006  [TP_Keystone_Electronics_5006]  (hidden comment: TP_Keystone_Electronics_5006)
TP84  Series: 5006  [TP_Keystone_Electronics_5006]  (hidden comment: TP_Keystone_Electronics_5006)
TP85  Series: 5006  [TP_Keystone_Electronics_5006]  (hidden comment: TP_Keystone_Electronics_5006)
TP86  Series: 5006  [TP_Keystone_Electronics_5006]  (hidden comment: TP_Keystone_Electronics_5006)
TP87  Series: 5006  [TP_Keystone_Electronics_5006]  (hidden comment: TP_Keystone_Electronics_5006)
TP88  Series: 5006  [TP_Keystone_Electronics_5006]  (hidden comment: TP_Keystone_Electronics_5006)
U56  AD5675  [CP_20_8]  (value not drawn)
U57  ADR4520BRZ-R7  [ADI-R-8_M]  (part A of 2)

### Blocks framed on the sheet
Place as close as possible (ideally up against device): C337 C338 FB8

### Ports
BIAS (out), I2C_DAC (harness DAC  I2C), IN+_OFS (out), IN-_OFS (out), ROFS (out), V_CM (out), VCAL_RESET (in), ~{SHDN} (in)

### Harnesses
DAC  I2C: SCL, SDA

### Nets
2V5_REF: C339.2 TP80.1 U56.15(VREF) U57.6(VOUT)
3.3V: FB1.1 FB8.1 FB13.1 FB14.1
TRB_GND: C335.2 C336.1 C337.2 C338.1 C339.1 C340.2 C341.2 C342.1 C343.2 C344.2 C345.1 OP3.4(V-) OP3.11(V-) OP4.4(V-) OP4.11(V-) TP83.1 TP84.1 TP85.1 TP86.1 TP87.1 TP88.1 U56.4(A0) U56.5(A1) U56.11(GND) U56.12(~{LDAC}) U56.21(EP(GND)) U57.4(GND)
BIAS: TP78.1 U56.9(VOUT4) ; port BIAS
CM: OP4.7(IN_A+) TP76.1 U56.17(VOUT3)
~{IN}~{_OFS}: R271.2 ; port IN-_OFS
IN+_OFS: R272.2 ; port IN+_OFS
R-OFS: U56.18(VOUT2) ; port ROFS
~{SHDN}: OP3.5(~{SDA}) OP3.6(~{SDB}) OP4.6(~{SDB}) ; port ~{SHDN}
SCL_DAC: U56.3(SCL) ; port I2C_DAC.SCL
SDA_DAC: U56.13(SDA) ; port I2C_DAC.SDA
V_CM: R270.2 ; port V_CM
VCAL_RESET: U56.14(~{RESET}) ; port VCAL_RESET
VOUT+: OP3.7(IN_A+) TP74.1 U56.19(VOUT1)
VOUT-: OP3.3(IN_A+) TP73.1 U56.20(VOUT0)
NetC335_1: C335.1 C336.2 FB1.2 TP72.1 U56.1(VDD) U56.2(VLOGIC)
NetC337_1: C337.1 C338.2 FB8.2 TP79.1 U57.2(VIN)
NetC340_1: C340.1 C341.1 C342.2 FB13.2 OP3.10(V+) TP81.1
NetC343_1: C343.1 C344.1 C345.2 FB14.2 OP4.10(V+) TP82.1
NetOP3_1: OP3.1(OUT_A) OP3.2(IN_A-) R271.1
NetOP3_8: OP3.8(IN_A-) OP3.9(OUT_A) R272.1
NetOP4_8: OP4.8(IN_A-) OP4.9(OUT_A) R270.1

Not connected (* = marked no-connect by the designer): U56 6(VOUT7)* 7(VOUT6)* 8(VOUT5)* 10(NIC)* 16(NIC)*

### Notes on the sheet
- Output current drive: 15 mA
- VCAL RESET: Pull-up resistor provided by GPIO Expander, CY8C9560A-24AXI.
- (near FB1) Place as close as possible (ideally up against device)
- Mount on analog plane
- (near U56) ADDRESS: 0X0C
- (near R271) *TBD
- (near R272) *TBD
- (near R270) *TBD
- Pair with DAC probe signal
- 475 Portola Plaza
- GAPS TOF
- igarcia91@g.ucla.edu
- Los Angeles, CA
- 310-825-0344
- Size:
- Date:
- Letter
- Number:
- Time:
- Sheet
- Revision:
- of
- andrew.peck@cern.ch
- spq@ucla.edu
- File:

### Library data of the parts
C335 C337 C340 C343 = Cap_Murata_ GRM21BC71E106ME11L_10uF: CAP CER 10uF 25V X7R 0805; Supplier 1: Mouser; Supplier Part Number 1: 81-GRM21BC71E106ME1L
C336 C338 C339 C342 C345 = Cap_Taiyo_Yuden_TMK105B7104KV-FR_100nF: CAP CER 100nF 25V X7R 0402; Supplier 1: Mouser; Supplier Part Number 1: 963-TMK105B7104KV-FR
C341 C344 = Cap_Kemet_C0603C103J5RACTU_eec: CAP CER 10nF 50V X7R 0603; Manufacturer: Kemet; Mfg Package Ident: C0603; Part Number: C0603C103J5RACTU; helpURL: https://upverter.com/upn/revision/8a8d0c297e33ac74/; ComponentLink2Description: Datasheet; Temperature: -55°C to +125°C; Package: C0603; Supplier 2: Mouser; Price: 0.0184203126773; Supplier 1: Digi-Key; ComponentLink1URL: https://upverter.com/upn/revision/8a8d0c297e33ac74/; Supplier Part Number 2: 80-C0603C103J5R; Supplier Part Number 1: 399-1092-1-ND; Value: 10nF; ComponentLink1Description: Upverter; ComponentLink2URL: https://content.kemet.com/datasheets/KEM_C1002_X7R_SMD.pdf; RoHS: TRUE; Mouser Part Number: 80-C0603C103J5R; Temperature Range High: +125°C; Digikey Description: CAP CER 10000PF 50V X7R 0603; Digikey Part Number: 399-1092-1-ND; Lead Free: yes; Temperature Range Low: -55°C; Voltage: 50V
FB1 FB8 = FB_Wurth_Electronics_742792731_100Ohms: FB SMD 100 OHM 25% 1.2A 0402; DC Resistance: 90mOhm; Supplier 1: Mouser; Supplier Part Number 1: 710-742792731
FB13 FB14 = FBMH4532HM681-T: Chip Bead Inductor for Power Lines, 680 Ohm, 4 A, -40 to 125 degC, 2-Pin 4.5 x 3.2 x 3.5 mm SMD, RoHS, Taping; Manufacturer: Taiyo Yuden; Rated Current: 4 A Max.; Impedance Tolerance: +/- 25%; ComponentLink1Description: Manufacturer URL; ComponentLink2Description: Datasheet; DatasheetVersion: 09/2014; ComponentLink3URL: http://www.yuden.co.jp/productdata/catalog/en/chipbeads01_e.pdf; ComponentLink3Description: Package Specification; ComponentLink1URL: http://www.t-yuden.com/; Mounting Technology: Surface Mount; Packing: Taping; Temperature Range: -40 to 125 degC; PartNumber: FBMH4532HM681-T; PackageDescription: 2-Pin Surface Mount Device, Body 4.5 x 3.2 mm, Height 3.5 mm; ComponentLink2URL: http://www.yuden.co.jp/productdata/catalog/en/chipbeads01_e.pdf; RoHS: TRUE; Supplier 1: Digi-Key; Supplier Part Number 1: 587-1761-6-ND
OP3 OP4 = OpAmp_Linear_Technology_ LTC6269HDD#PBF_500Mhz: IC OPAMP 500MHZ DUAL FET 10DFN; Supplier 1: Digi-Key; Supplier Part Number 1: LTC6269HDD#PBF-ND
R270-R272 = Res_Vishay_CRCW04020000Z0EDC_0_Ohm: 0R 0.062W 1% 0402 (1005 Metric)  SMD; Supplier 1: Mouser; Supplier Part Number 1: 71-CRCW04020000Z0EDC
TP72-TP74 TP76 TP78-TP82 = TP_Harwin_S2761_46R: Circuit Board Hardware - PCB SMT Mini Test Terminal, Reel; Supplier 1: Newark; Supplier Part Number 1: 76Y5391
TP83-TP88 = TP_Keystone_Electronics_5006: Circuit Board Hardware - PCB TEST POINT BLK .063; Supplier 1: Mouser; Supplier Part Number 1: 534-5006
U56 = AD5675BCPZ-REEL7: Digital to Analog Converters - DAC 16-bit octal I2C nanoDAC; Vendor: Analog Devices Inc; Built_By: Analog Devices Inc.; Manufacturer_Part_Number: AD5675BCPZ-REEL7; RefDes: RefDes; Type: DEV; Value: Value; Supplier Part Number 1: 584-AD5675BCPZ-REEL7; Supplier 1: Mouser; Series: AD5675BCPZ-REEL7
U57 = CMP-0784-00295-1: Ultralow Noise, High Accuracy Voltage Reference, 2.048 V Output, 3 to 15 V Supply, Industrial, 8-pin SOIC (R-8), Reel; Manufacturer: Analog Devices; Min V Supply (V): 3; Vout: 2.048V; Max V Supply (V): 15; Ref Out TC (ppm/C): 2; ComponentLink3Description: Package Specification; Packing: Reel; ComponentLink1URL: http://www.analog.com/en/index.html; ComponentLink3URL: http://www.analog.com/static/imported-files/packages/PKG_PDF/SOIC_Narrow%20(R)/R_8.pdf; ComponentLink2URL: http://www.analog.com/static/imported-files/data_sheets/ADR4520_4525_4530_4533_4540_4550.pdf; ComponentLink2Description: Datasheet; PartNumber: ADR4520BRZ-R7; ComponentLink1Description: Manufacturer URL; PackageVersion: 060506-A, 06/2006; Operating Temp Range: -40 to 125 degC; ComponentLink4URL: Product URL:http://www.analog.com/en/special-linear-functions/voltage-references/adr4520/products/product.html; PackageReference: R-8; Code_JEDEC: MS-012-AA; Mounting Technology: Surface Mount; DatasheetVersion: Rev. 0; ComponentLink4Description: URL Link1; PackageDescription: 8-Pin Standard Small Outline Package, Body 4.9 x 3.9 mm, Pitch 1.27 mm

## Sheet CLK_SYNTH.SchDoc: My title
size A3; Organization: University of California; Address1: 475 Portola Plaza; Address2: Los Angeles, CA 90095; Revision: R01; SheetNumber: 1; SheetTotal: 1
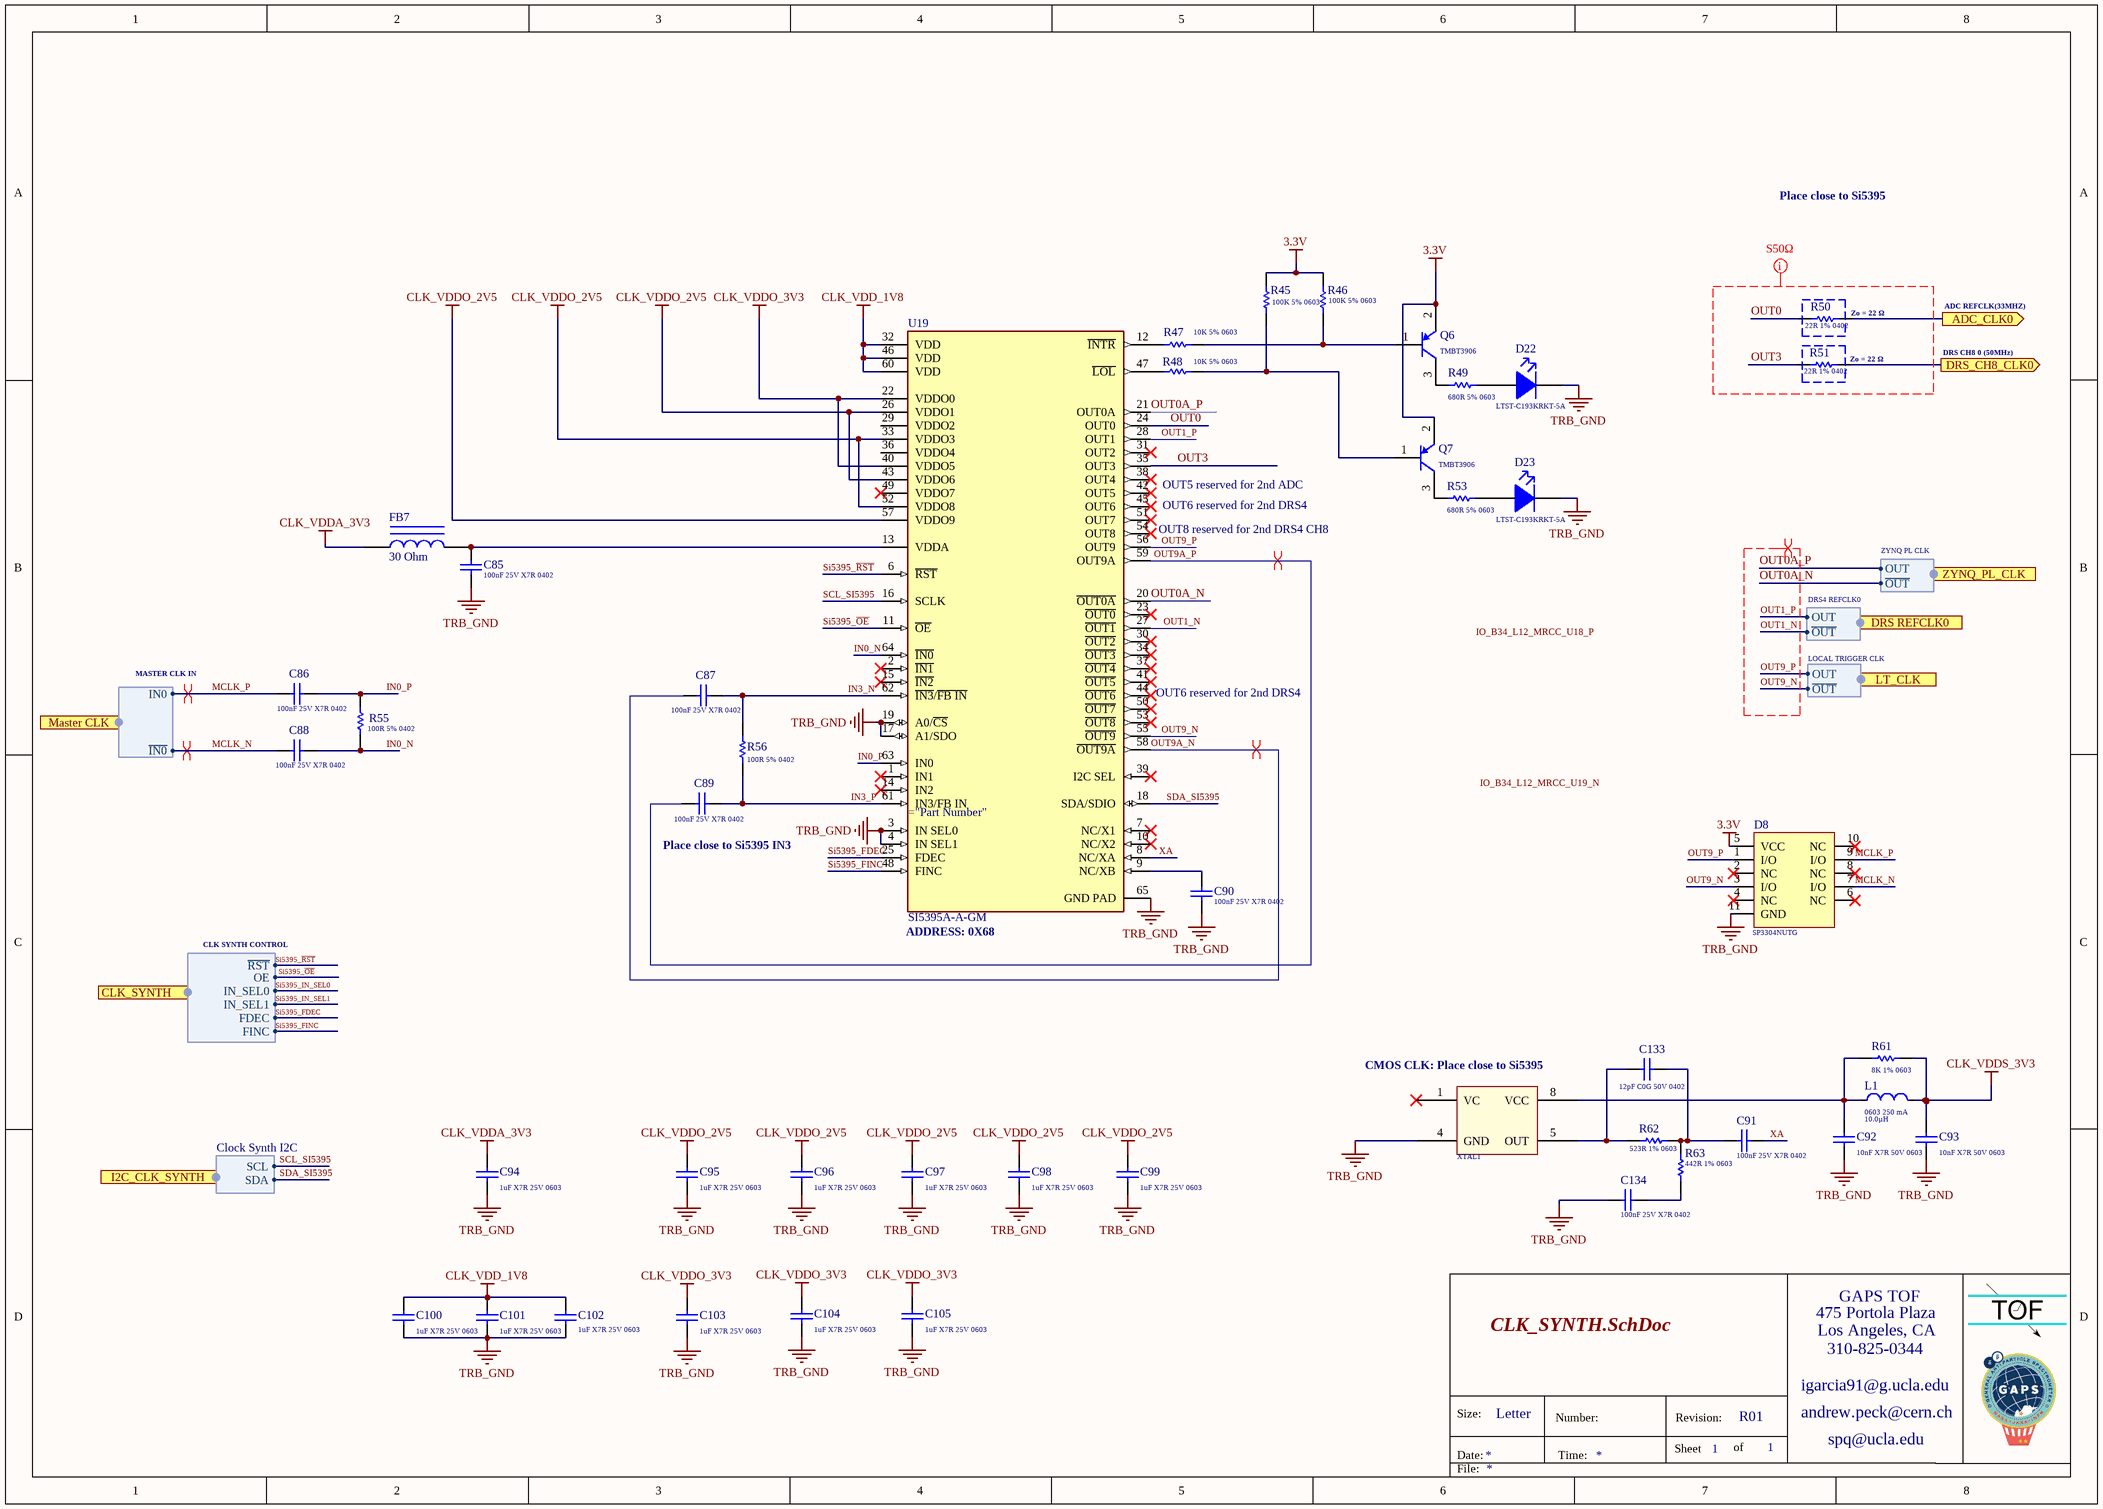
[diagram p9: CLK_SYNTH.SchDoc]

### Parts
C85  Capacitance: 100nF 25V X7R 0402  [Cap_Taiyo_Yuden_TMK105B7104KV-FR_100nF]  (hidden comment: Cap_Taiyo_Yuden_TMK105B7104KV-FR_100nF)
C86  Capacitance: 100nF 25V X7R 0402  [Cap_Taiyo_Yuden_TMK105B7104KV-FR_100nF]  (hidden comment: Cap_Taiyo_Yuden_TMK105B7104KV-FR_100nF)
C87  Capacitance: 100nF 25V X7R 0402  [Cap_Taiyo_Yuden_TMK105B7104KV-FR_100nF]  (hidden comment: Cap_Taiyo_Yuden_TMK105B7104KV-FR_100nF)
C88  Capacitance: 100nF 25V X7R 0402  [Cap_Taiyo_Yuden_TMK105B7104KV-FR_100nF]  (hidden comment: Cap_Taiyo_Yuden_TMK105B7104KV-FR_100nF)
C89  Capacitance: 100nF 25V X7R 0402  [Cap_Taiyo_Yuden_TMK105B7104KV-FR_100nF]  (hidden comment: Cap_Taiyo_Yuden_TMK105B7104KV-FR_100nF)
C90  Capacitance: 100nF 25V X7R 0402  [Cap_Taiyo_Yuden_TMK105B7104KV-FR_100nF]  (hidden comment: Cap_Taiyo_Yuden_TMK105B7104KV-FR_100nF)
C91  Capacitance: 100nF 25V X7R 0402  [Cap_Taiyo_Yuden_TMK105B7104KV-FR_100nF]  (hidden comment: Cap_Taiyo_Yuden_TMK105B7104KV-FR_100nF)
C92  Capacitance: 10nF X7R 50V 0603  [Kemet_C0603_0]  (hidden comment: Cap_Kemet_C0603C103J5RACTU_eec)
C93  Capacitance: 10nF X7R 50V 0603  [Kemet_C0603_0]  (hidden comment: Cap_Kemet_C0603C103J5RACTU_eec)
C94  Capacitance: 1uF X7R 25V 0603  [Cap_Murata_GCJ188R71E105KA01J_1uF]  (hidden comment: Cap_Murata_GCJ188R71E105KA01J_1uF)
C95  Capacitance: 1uF X7R 25V 0603  [Cap_Murata_GCJ188R71E105KA01J_1uF]  (hidden comment: Cap_Murata_GCJ188R71E105KA01J_1uF)
C96  Capacitance: 1uF X7R 25V 0603  [Cap_Murata_GCJ188R71E105KA01J_1uF]  (hidden comment: Cap_Murata_GCJ188R71E105KA01J_1uF)
C97  Capacitance: 1uF X7R 25V 0603  [Cap_Murata_GCJ188R71E105KA01J_1uF]  (hidden comment: Cap_Murata_GCJ188R71E105KA01J_1uF)
C98  Capacitance: 1uF X7R 25V 0603  [Cap_Murata_GCJ188R71E105KA01J_1uF]  (hidden comment: Cap_Murata_GCJ188R71E105KA01J_1uF)
C99  Capacitance: 1uF X7R 25V 0603  [Cap_Murata_GCJ188R71E105KA01J_1uF]  (hidden comment: Cap_Murata_GCJ188R71E105KA01J_1uF)
C100  Capacitance: 1uF X7R 25V 0603  [Cap_Murata_GCJ188R71E105KA01J_1uF]  (hidden comment: Cap_Murata_GCJ188R71E105KA01J_1uF)
C101  Capacitance: 1uF X7R 25V 0603  [Cap_Murata_GCJ188R71E105KA01J_1uF]  (hidden comment: Cap_Murata_GCJ188R71E105KA01J_1uF)
C102  Capacitance: 1uF X7R 25V 0603  [Cap_Murata_GCJ188R71E105KA01J_1uF]  (hidden comment: Cap_Murata_GCJ188R71E105KA01J_1uF)
C103  Capacitance: 1uF X7R 25V 0603  [Cap_Murata_GCJ188R71E105KA01J_1uF]  (hidden comment: Cap_Murata_GCJ188R71E105KA01J_1uF)
C104  Capacitance: 1uF X7R 25V 0603  [Cap_Murata_GCJ188R71E105KA01J_1uF]  (hidden comment: Cap_Murata_GCJ188R71E105KA01J_1uF)
C105  Capacitance: 1uF X7R 25V 0603  [Cap_Murata_GCJ188R71E105KA01J_1uF]  (hidden comment: Cap_Murata_GCJ188R71E105KA01J_1uF)
C133  Capacitance: 12pF C0G 50V 0402  [Cap_Murata_GCQ1555C1H120FB01D_12pF]  (hidden comment: Cap_Murata_GCQ1555C1H120FB01D_12pF)
C134  Capacitance: 100nF 25V X7R 0402  [Cap_Taiyo_Yuden_TMK105B7104KV-FR_100nF]  (hidden comment: Cap_Taiyo_Yuden_TMK105B7104KV-FR_100nF)
D8  Series: SP3304NUTG  [ESD_LittleFuse_SP3304NUTG_3V3]  (hidden comment: ESD_LittleFuse_SP3304NUTG_3V3)
D22  LTST-C193KRKT-5A  [Led_Lite-On_LTST-C193KGKT-5A_Red]
D23  LTST-C193KRKT-5A  [Led_Lite-On_LTST-C193KGKT-5A_Red]
FB7  30 Ohm  [Feb_MURATA_BLM15AX300SZ1D_30]
L1  0603 250 mA  Inductance: 10.0µH  [TDK_MLZ1608M100WT_0]
Q6  Series: TMBT3906  [BJT_PNP_Toshiba_TMBT3906]  (hidden comment: BJT_PNP_Toshiba_TMBT3906)
Q7  Series: TMBT3906  [BJT_PNP_Toshiba_TMBT3906]  (hidden comment: BJT_PNP_Toshiba_TMBT3906)
R45  100K 5% 0603  [RESC0603(1608)_N]
R46  100K 5% 0603  [RESC0603(1608)_N]
R47  10K 5% 0603  [RESC0603(1608)_L]
R48  10K 5% 0603  [RESC0603(1608)_L]
R49  680R 5% 0603  [RESC0603(1608)_L]
R50  22R 1% 0402  [RESC0402(1005)_L]
R51  22R 1% 0402  [RESC0402(1005)_L]
R53  680R 5% 0603  [RESC0603(1608)_L]
R55  100R 5% 0402  [RESC0402(1005)_L]
R56  100R 5% 0402  [RESC0402(1005)_L]
R61  8K 1% 0603  [Res_Yageo_RT0603BRE078KL_8K]
R62  Resistance: 523R 1% 0603  [Res_Vishay_CRCW0603523RFKEA_523Ohm]  (hidden comment: Res_Vishay_CRCW0603523RFKEA_523Ohm)
R63  Resistance: 442R 1% 0603  [Res_Bourns_CR0603-FX-4420ELF_442Ohm]  (hidden comment: Res_Bourns_CR0603-FX-4420ELF_442Ohm)
U19  Series: SI5395A-A-GM  [Si5395]  (hidden comment: IC_Silicon_Laboratories_ SI5395A-A-GM_CLK)
XTAL1  TCXO_Murata_XTCLH50M000CHJA3P0_50MHz  [TCXO_Murata_XTCLH50M000CHJA3P0_50MHz]  (value not drawn)

### Ports
ADC_CLK0 (out), CLK_SYNTH (harness CLK SYNTH CONTROL), DRS REFCLK0 (harness DRS4 REFCLK0), DRS_CH8_CLK0 (out), I2C_CLK_SYNTH (harness Clock Synth I2C), LT_CLK (harness LOCAL TRIGGER CLK), Master CLK (harness MASTER CLK IN), ZYNQ_PL_CLK (harness ZYNQ PL CLK)

### Harnesses
MASTER CLK IN: IN0, ~{IN0}
CLK SYNTH CONTROL: ~{RST}, OE, IN_SEL0, IN_SEL1, FDEC, FINC
DRS4 REFCLK0: OUT, ~{OUT}
ZYNQ PL CLK: OUT, ~{OUT}
LOCAL TRIGGER CLK: OUT, ~{OUT}
Clock Synth I2C: SCL, SDA

### Nets
3.3V: D8.5(VCC) Q6.2(E) Q7.2(E) R45.2 R46.2
CLK_VDD_1V8: C100.2 C101.2 C102.2 U19.32(VDD) U19.46(VDD) U19.60(VDD)
CLK_VDDA_3V3: C94.2 FB7.1
CLK_VDDO_2V5: C95.2 C96.2 C97.2 C98.2 C99.2 U19.26(VDDO1) U19.33(VDDO3) U19.43(VDDO6) U19.52(VDDO8) U19.57(VDDO9)
CLK_VDDO_3V3: C103.2 C104.2 C105.2 U19.22(VDDO0) U19.40(VDDO5)
CLK_VDDS_3V3: C93.1 L1.2 R61.2
TRB_GND: C85.1 C90.1 C92.2 C93.2 C94.1 C95.1 C96.1 C97.1 C98.1 C99.1 C100.1 C101.1 C102.1 C103.1 C104.1 C105.1 C134.1 D8.11(GND) D22.1(K) D23.1(K) U19.3(IN_SEL0) U19.4(IN_SEL1) U19.17(A1/SDO) U19.19(A0/~{CS}) U19.65(GND_PAD) XTAL1.4(GND)
ADC_CLK: R50.1 ; port ADC_CLK0
CLK_SYNTH_8: R51.1 ; port DRS_CH8_CLK0
IN0_N: C88.2 R55.1 U19.64(~{IN0})
IN0_P: C86.2 R55.2 U19.63(IN0)
IN3_N: C87.2 R56.2 U19.62(~{IN3}/~{FB_IN})
IN3_P: C89.2 R56.1 U19.61(IN3/FB_IN)
MCLK_N: C88.1 D8.7(I/O) ; port Master CLK.~{IN0}
MCLK_P: C86.1 D8.9(I/O) ; port Master CLK.IN0
OUT0: R50.2 U19.24(OUT0)
OUT0A_N: U19.20(~{OUT0A}) ; port ZYNQ_PL_CLK.~{OUT}
OUT0A_P: U19.21(OUT0A) ; port ZYNQ_PL_CLK.OUT
OUT1_N: U19.27(~{OUT1}) ; port DRS REFCLK0.~{OUT}
OUT1_P: U19.28(OUT1) ; port DRS REFCLK0.OUT
OUT3: R51.2 U19.35(OUT3)
OUT9_N: D8.3(I/O) U19.55(~{OUT9}) ; port LT_CLK.~{OUT}
OUT9_P: D8.1(I/O) U19.56(OUT9) ; port LT_CLK.OUT
OUT9A_N: C87.1 U19.58(~{OUT9A})
OUT9A_P: C89.1 U19.59(OUT9A)
SCL_SI5395: U19.16(SCLK) ; port I2C_CLK_SYNTH.SCL
SDA_SI5395: U19.18(SDA/SDIO) ; port I2C_CLK_SYNTH.SDA
Si5395_FDEC: U19.25(FDEC) ; port CLK_SYNTH.FDEC
Si5395_FINC: U19.48(FINC) ; port CLK_SYNTH.FINC
Si5395_IN_SEL0: port CLK_SYNTH.IN_SEL0
Si5395_IN_SEL1: port CLK_SYNTH.IN_SEL1
Si5395_~{OE}: U19.11(~{OE}) ; port CLK_SYNTH.OE
Si5395_~{RST}: U19.6(~{RST}) ; port CLK_SYNTH.~{RST}
XA: C91.2 U19.8(NC/XA)
NetC85_2: C85.2 FB7.2 U19.13(VDDA)
NetC90_2: C90.2 U19.9(NC/XB)
NetC91_1: C91.1 C133.1 R62.2 R63.2
NetC92_1: C92.1 L1.1 R61.1 XTAL1.8(VCC)
NetC133_2: C133.2 R62.1 XTAL1.5(OUT)
NetC134_2: C134.2 R63.1
NetD22_2: D22.2(A) R49.2
NetD23_2: D23.2(A) R53.2
NetQ6_1: Q6.1(B) R46.1 R47.1
NetQ6_3: Q6.3(C) R49.1
NetQ7_1: Q7.1(B) R45.1 R48.1
NetQ7_3: Q7.3(C) R53.1
NetR47_2: R47.2 U19.12(~{INTR})
NetR48_2: R48.2 U19.47(~{LOL})

Not connected (* = marked no-connect by the designer): D8 2(NC)* 4(NC)* 6(NC)* 8(NC)* 10(NC)*; U19 1(IN1)* 2(~{IN1})* 7(NC/X1)* 10(NC/X2)* 14(IN2)* 15(~{IN2})* 23(~{OUT0})* 29(VDDO2) 30(~{OUT2})* 31(OUT2)* 34(~{OUT3})* 36(VDDO4) 37(~{OUT4})* 38(OUT4)* 39(I2C_SEL)* 41(~{OUT5})* 42(OUT5)* 44(~{OUT6})* 45(OUT6)* 49(VDDO7)* 50(~{OUT7})* 51(OUT7)* 53(~{OUT8})* 54(OUT8)*; XTAL1 1(VC)*

### Layout directives
differential pair: MCLK_N, MCLK_P, OUT0A_N, OUT0A_P, OUT1_N, OUT1_P, OUT9_N, OUT9_P, OUT9A_N, OUT9A_P
net class S50: OUT0, OUT3

### Notes on the sheet
- Place close to Si5395
- (near R50) Zo = 22 Ω
- ADC REFCLK(33MHZ)
- (near R51) Zo = 22 Ω
- DRS CH8 0 (50MHz)
- (near U19) OUT5 reserved for 2nd ADC
- (near U19) OUT6 reserved for 2nd DRS4
- (near U19) OUT8 reserved for 2nd DRS4 CH8
- (near C89) Place close to Si5395 IN3
- (near U19) ADDRESS: 0X68
- (near XTAL1) CMOS CLK: Place close to Si5395
- Labels drawn without touching a wire or pin: IO_B34_L12_MRCC_U18_P, IO_B34_L12_MRCC_U19_N
- 475 Portola Plaza
- GAPS TOF
- igarcia91@g.ucla.edu
- Los Angeles, CA
- 310-825-0344
- Size:
- Date:
- Letter
- Number:
- Time:
- Sheet
- Revision:
- of
- andrew.peck@cern.ch
- spq@ucla.edu
- File:

### Library data of the parts
C85-C91 C134 = Cap_Taiyo_Yuden_TMK105B7104KV-FR_100nF: CAP CER 100nF 25V X7R 0402; Supplier 1: Mouser; Supplier Part Number 1: 963-TMK105B7104KV-FR
C92 C93 = Cap_Kemet_C0603C103J5RACTU_eec: as C341 on sheet DAC; Part Number: C0603C103J5RACTU; helpURL: https://upverter.com/upn/revision/8a8d0c297e33ac74/; ComponentLink2Description: Datasheet; Temperature: -55°C to +125°C; Package: C0603; Supplier 2: Mouser; Price: 0.0184203126773; Supplier 1: Digi-Key; ComponentLink1URL: https://upverter.com/upn/revision/8a8d0c297e33ac74/; Supplier Part Number 2: 80-C0603C103J5R; Supplier Part Number 1: 399-1092-1-ND; Value: 10nF; ComponentLink1Description: Upverter; ComponentLink2URL: https://content.kemet.com/datasheets/KEM_C1002_X7R_SMD.pdf; RoHS: TRUE; Mouser Part Number: 80-C0603C103J5R; Temperature Range High: +125°C; Digikey Description: CAP CER 10000PF 50V X7R 0603; Digikey Part Number: 399-1092-1-ND; Lead Free: yes; Temperature Range Low: -55°C; Voltage: 50V
C94-C105 = Cap_Murata_GCJ188R71E105KA01J_1uF: CAP CER 1uF 25V X7R 0603; Supplier 1: Mouser; Supplier Part Number 1: 81-GCJ188R71E105KA1J
C133 = Cap_Murata_GCQ1555C1H120FB01D_12pF: Multilayer Ceramic Capacitors MLCC - SMD/SMT 0402 50VDC 12pF 1% AEC-Q200; Supplier 1: Mouser; Supplier Part Number 1: 81-GCQ1555C1H120FB1D  81-GCQ1555C1H120FB1D
D8 = ESD_LittleFuse_SP3304NUTG_3V3: ESD Suppressors / TVS Diodes 4CH 20A 3.3V 3.5pF Lightning Protection; Supplier Part Number 1: 576-SP3304NUTG; Supplier 1: Mouser
D22 D23 = Led_Lite-On_LTST-C193KGKT-5A_Red: Standard LEDs - SMD Red 470nm 28mcd 20mA; Supplier 1: Mouser; Supplier Part Number 1: 859-LTSTC193KRKT5A; Series: LTST-C193KRKT-5A
FB7 = Feb_MURATA_BLM15AX300SZ1D_30: Feb SMD 30 OHM 25% 3/4W 0402; Supplier 1: Mouser; Supplier Part Number 1: 81-BLM15AX300SZ1D
L1 = Ind_TDK_MLZ1608M100WT_eec: IND 10µH Shielded Multilayer Inductor 250mA 1.365 Ohm Max 0603 (1608 Metric); Manufacturer: TDK; Value: 10.0µH; Tolerance: ±20%; Part Number: MLZ1608M100WT; helpURL: https://upverter.com/upn/revision/22fa022ced0eb0ec/; ComponentLink2Description: Datasheet; Temperature: -55°C to +125°C; Package: 0603 (1608 metric); Supplier 2: Mouser; Supplier 1: Digi-Key; ComponentLink1URL: https://upverter.com/upn/revision/22fa022ced0eb0ec/; Supplier Part Number 2: 810-MLZ1608M100WT000; Supplier Part Number 1: 445-6389-1-ND; ComponentLink1Description: Upverter; ComponentLink2URL: https://product.tdk.com/info/en/catalog/datasheets/inductor_commercial_decoupling_mlz1608_en.pdf; RoHS: TRUE; Mouser Part Number: 810-MLZ1608M100WT000; Current Rating: 250mA; Ipc Land Pattern Name: CAPC16080X45; Temperature Range High: +125°C; Digikey Description: IND 10µH Shielded Multilayer Inductor 250mA 1.365 Ohm Max 0603 (1608 Metric); Digikey Part Number: 445-6389-1-ND; Lead Free: yes; Temperature Range Low: -55°C; DC Resistance (DCR): 1.365 Ohm Max
Q6 Q7 = BJT_PNP_Toshiba_TMBT3906: Bipolar Transistors - BJT Transistor for Low Freq. Amplification; Supplier Part Number 1: TMBT3906,LM; Supplier 1: Mouser
R45 R46 = CMP-1012-00122-1: 100K 0.1W 5% 0603 (1608 Metric)  SMD; Case-EIA: 0603; Value: 100000.00 Ohm; Case-Metric: 1608; Tolerance: 5 %; Power: 0.1 W; Technology: SMT
R47 R48 = CMP-1012-00098-1: 10K 0.1W 5% 0603 (1608 Metric)  SMD; Case-EIA: 0603; Value: 10000.00 Ohm; Case-Metric: 1608; Technology: SMT; Tolerance: 5 %; Power: 0.1 W
R49 R53 = CMP-1012-00070-1: 680R 0.1W 5% 0603 (1608 Metric)  SMD; Case-EIA: 0603; Value: 680.00 Ohm; Case-Metric: 1608; Tolerance: 5 %; Technology: SMT; Power: 0.1 W
R50 R51 = CMP-1011-00320-1: 22R 0.063W 1% 0402 (1005 Metric)  SMD; Case-EIA: 0402; Case-Metric: 1005; Value: 22.00 Ohm; Tolerance: 1 %; Technology: SMT; Power: 0.063 W
R55 R56 = CMP-1011-00050-1: 100R 0.063W 5% 0402 (1005 Metric)  SMD; Case-EIA: 0402; Value: 100.00 Ohm; Case-Metric: 1005; Tolerance: 5 %; Technology: SMT; Power: 0.063 W
R61 = Res_Yageo_RT0603BRE078KL_8K: 8K 0.1W 1% 0603 (1608 Metric)  SMD; Supplier 1: Mouser; Supplier Part Number 1: 603-RT0603BRE078KL
R62 = Res_Vishay_CRCW0603523RFKEA_523Ohm: RES SMD 523 OHM 1% 1/10W 0603; Supplier 1: Mouser; Supplier Part Number 1: 71-CRCW0603-523-E3
R63 = Res_Bourns_CR0603-FX-4420ELF_442Ohm: RES SMD 442 OHM 1% 1/10W 0603; Supplier Part Number 1: 652-CR0603FX-4420ELF; Supplier 1: Mouser
U19 = IC_Silicon_Laboratories_ SI5395A-A-GM_CLK: Clock Synthesizer / Jitter Cleaner Single PLL jitter attenuator with xtal: 12-outputs up to 1028 MHz; integer+fractional; Supplier 1: Mouser; Supplier Part Number 1: 634-SI5395A-A-GM
XTAL1 = TCXO_Murata_XTCLH50M000CHJA3P0_50MHz: TCXO Oscillators 50MHz 5x3.2x1.5mm 0.2ppm max Crystal; Supplier 1: Mouser; Supplier Part Number 1: 81-XTCLH50M000CHJA3P; Supplier 2: Digi-Key; Supplier Part Number 2: 490-18042-1-ND

## Sheet TCA_MODULE.SchDoc: TCA Module
size Letter; SheetNumber: 26; SheetTotal: 32
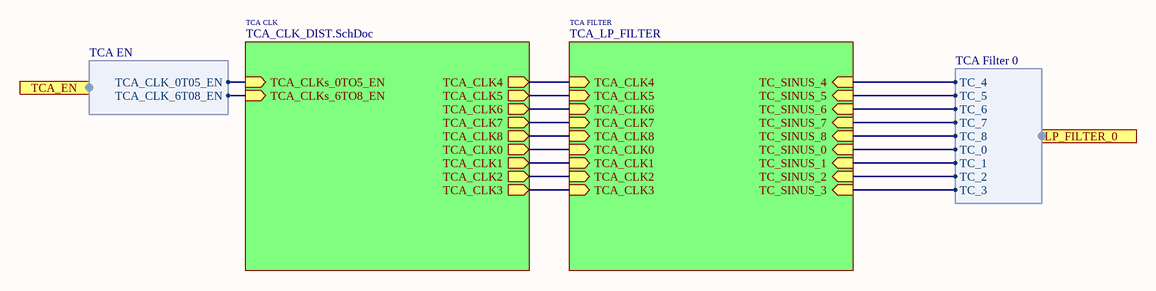
[diagram p10: TCA_MODULE.SchDoc]

### Sub-sheets
TCA CLK = TCA_CLK_DIST.SchDoc: TCA_CLK4 (out), TCA_CLK5 (out), TCA_CLK6 (out), TCA_CLK7 (out), TCA_CLK8 (out), TCA_CLK0 (out), TCA_CLK1 (out), TCA_CLK2 (out), TCA_CLKs_0TO5_EN (in), TCA_CLKs_6TO8_EN (in), TCA_CLK3 (out)
TCA FILTER = TCA_LP_FILTER: TCA_CLK4 (in), TCA_CLK5 (in), TCA_CLK6 (in), TCA_CLK0 (in), TCA_CLK1 (in), TCA_CLK2 (in), TCA_CLK3 (in), TCA_CLK7 (in), TCA_CLK8 (in), TC_SINUS_4 (in), TC_SINUS_5 (in), TC_SINUS_6 (in), TC_SINUS_0 (in), TC_SINUS_1 (in), TC_SINUS_2 (in), TC_SINUS_3 (in), TC_SINUS_7 (in), TC_SINUS_8 (in)

### Ports
LP_FILTER_0 (harness TCA Filter 0), TCA_EN (harness TCA EN)

### Harnesses
TCA Filter 0: TC_4, TC_5, TC_6, TC_7, TC_8, TC_0, TC_1, TC_2, TC_3
TCA EN: TCA_CLK_0T05_EN, TCA_CLK_6T08_EN

### Nets
TC_0: sheet TCA FILTER/TC_SINUS_0, port LP_FILTER_0.TC_0
TC_1: sheet TCA FILTER/TC_SINUS_1, port LP_FILTER_0.TC_1
TC_2: sheet TCA FILTER/TC_SINUS_2, port LP_FILTER_0.TC_2
TC_3: sheet TCA FILTER/TC_SINUS_3, port LP_FILTER_0.TC_3
TC_4: sheet TCA FILTER/TC_SINUS_4, port LP_FILTER_0.TC_4
TC_5: sheet TCA FILTER/TC_SINUS_5, port LP_FILTER_0.TC_5
TC_6: sheet TCA FILTER/TC_SINUS_6, port LP_FILTER_0.TC_6
TC_7: sheet TCA FILTER/TC_SINUS_7, port LP_FILTER_0.TC_7
TC_8: sheet TCA FILTER/TC_SINUS_8, port LP_FILTER_0.TC_8
TCA_CLK0: sheet TCA CLK/TCA_CLK0, sheet TCA FILTER/TCA_CLK0
TCA_CLK1: sheet TCA CLK/TCA_CLK1, sheet TCA FILTER/TCA_CLK1
TCA_CLK2: sheet TCA CLK/TCA_CLK2, sheet TCA FILTER/TCA_CLK2
TCA_CLK3: sheet TCA CLK/TCA_CLK3, sheet TCA FILTER/TCA_CLK3
TCA_CLK4: sheet TCA CLK/TCA_CLK4, sheet TCA FILTER/TCA_CLK4
TCA_CLK5: sheet TCA CLK/TCA_CLK5, sheet TCA FILTER/TCA_CLK5
TCA_CLK6: sheet TCA CLK/TCA_CLK6, sheet TCA FILTER/TCA_CLK6
TCA_CLK7: sheet TCA CLK/TCA_CLK7, sheet TCA FILTER/TCA_CLK7
TCA_CLK8: sheet TCA CLK/TCA_CLK8, sheet TCA FILTER/TCA_CLK8
TCA_CLK_0T05_EN: sheet TCA CLK/TCA_CLKs_0TO5_EN, port TCA_EN.TCA_CLK_0T05_EN
TCA_CLK_6T08_EN: sheet TCA CLK/TCA_CLKs_6TO8_EN, port TCA_EN.TCA_CLK_6T08_EN

### Notes on the sheet
- 475 Portola Plaza
- GAPS TOF
- Title
- igarcia91@g.ucla.edu
- Los Angeles, CA
- 310-825-0344
- Size:
- Date:
- Letter
- Number:
- Time:
- Sheet
- Revision:
- of
- andrew.peck@cern.ch
- spq@ucla.edu
- File: